# Altium schematic sheet 1_P1.schdoc
size 309 x 223 mm; Symbol: Sheet-Symbol_A4; Device: Sheet-Symbol_A4; Company: 嘉立创EDA; Version: V1.0; Page Size: A4; @Project Name: 鼠标终极板; @Page Count: 1; @Update Date: 2024-05-30; @Create Date: 2024-05-16; @Schematic Name: Schematic1; @Page No: 1; @Page Name: P1
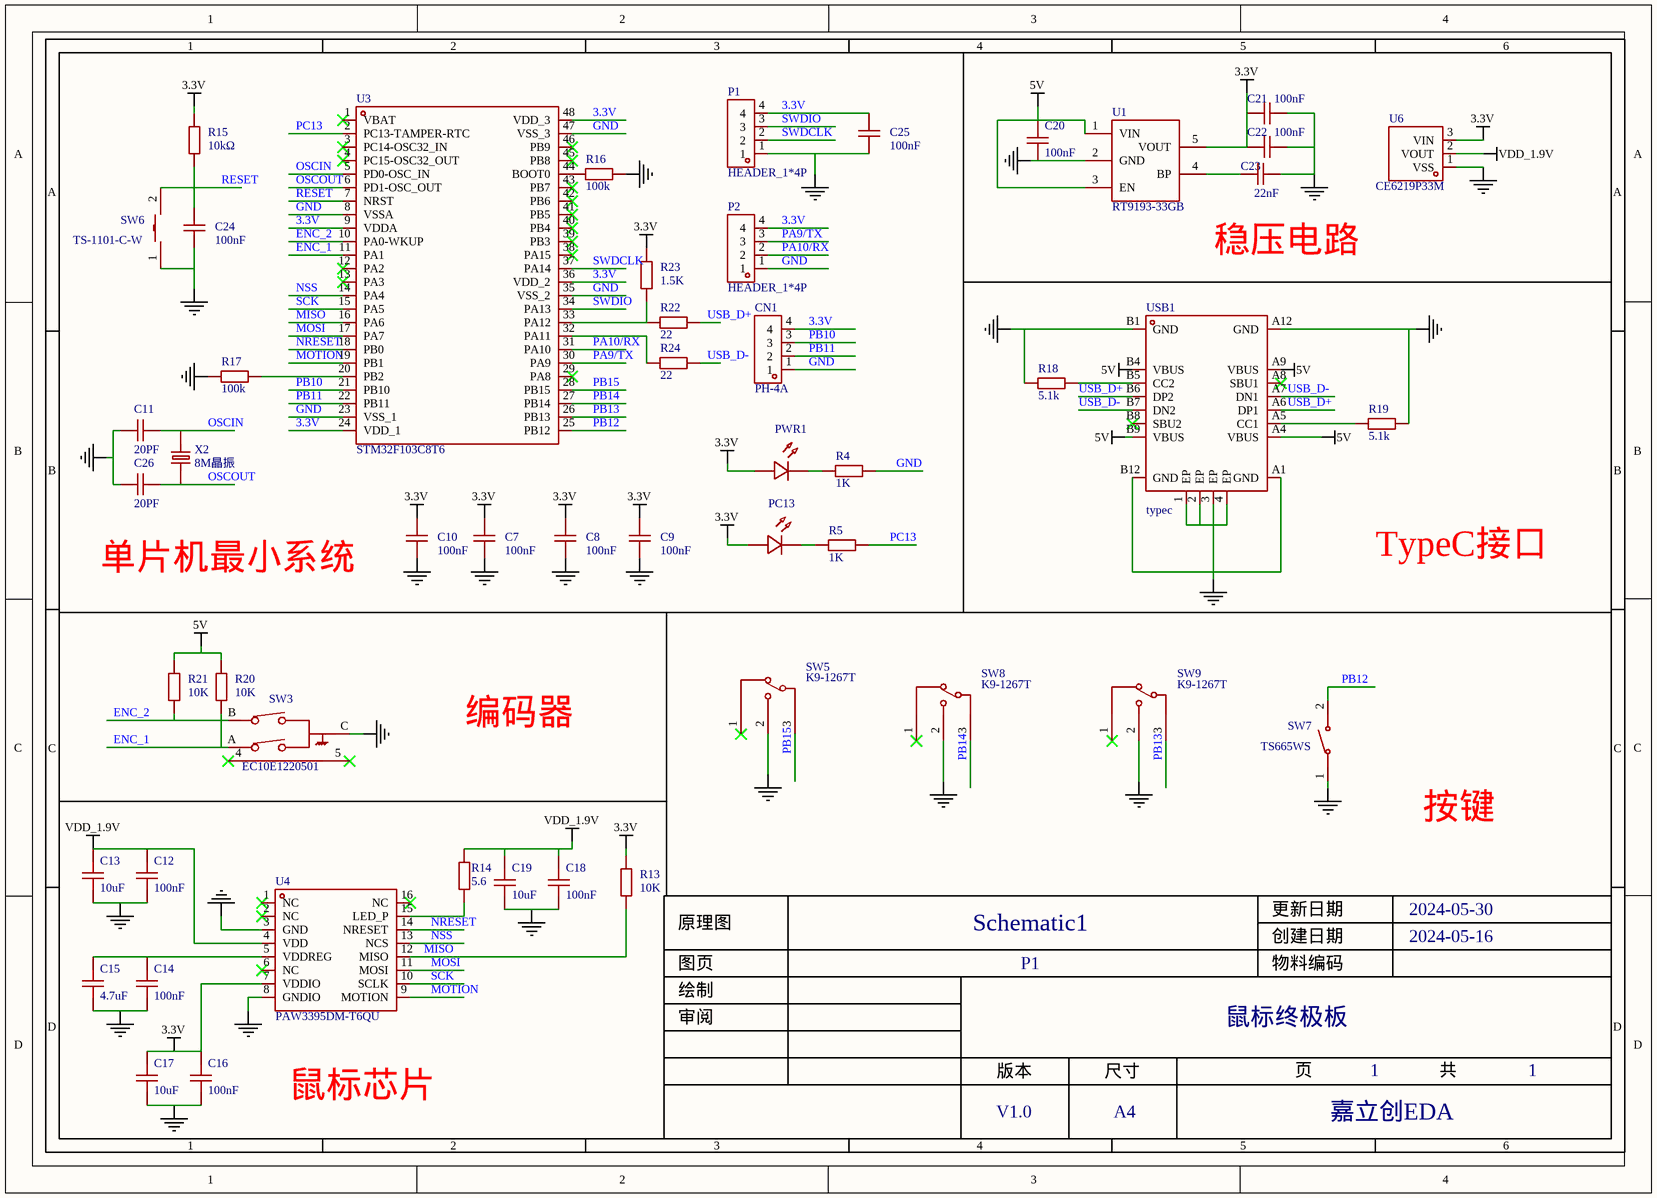
[diagram p0: 1_P1.schdoc]

## Parts
C7  100nF  [C0603]  (value not drawn)
C8  100nF  [C0603]  (value not drawn)
C9  100nF  [C0603]  (value not drawn)
C10  100nF  [C0603]  (value not drawn)
C11  20PF  [C0603]  (value not drawn)
C12  100nF  [C0603]  (value not drawn)
C13  10uF  [C0603]  (value not drawn)
C14  100nF  [C0603]  (value not drawn)
C15  4.7uF  [C0603]  (value not drawn)
C16  100nF  [C0603]  (value not drawn)
C17  10uF  [C0603]  (value not drawn)
C18  100nF  [C0603]  (value not drawn)
C19  10uF  [C0603]  (value not drawn)
C20  100nF  [C0603]  (value not drawn)
C21  100nF  [C0603]  (value not drawn)
C22  100nF  [C0603]  (value not drawn)
C23  22nF  [C0603]  (value not drawn)
C24  100nF  [C0603]  (value not drawn)
C25  100nF  [C0603]  (value not drawn)
C26  20PF  [C0603]  (value not drawn)
CN1  PH-4A  [CONN-TH_4P-P2.00_PH-4A_C2908625]  (value not drawn)
P1  HEADER_1*4P  [HDR-TH_4P-P2.54-V-M-1]  (value not drawn)
P2  HEADER_1*4P  [HDR-TH_4P-P2.54-V-M-1]  (value not drawn)
PC13  LED_0603-B  [LED_0603]  (value not drawn)
PWR1  LED_0603-R  [LED_0603]  (value not drawn)
R4  1K  [R0603]  (value not drawn)
R5  1K  [R0603]  (value not drawn)
R13  10K  [R0603]  (value not drawn)
R14  5.6  [R0603]  (value not drawn)
R15  10kΩ  [R0603]  (value not drawn)
R16  100k  [R0603]  (value not drawn)
R17  100k  [R0603]  (value not drawn)
R18  5.1k  [R0603]  (value not drawn)
R19  5.1k  [R0603]  (value not drawn)
R20  10K  [R0603]  (value not drawn)
R21  10K  [R0603]  (value not drawn)
R22  22  [R0603]  (value not drawn)
R23  1.5K  [R0603]  (value not drawn)
R24  22  [R0603]  (value not drawn)
SW3  EC10E1220501  [SW-TH_EC10EXXXXXXX]  (value not drawn)
SW5  K9-1267T  [SW-TH_K9-1267T]  (value not drawn)
SW6  TS-1101-C-W  [SW-SMD_L6.0-W3.3-LS8.0]  (value not drawn)
SW7  TS665WS  [SW-SMD_L6.0-W6.0-LS6.6]  (value not drawn)
SW8  K9-1267T  [SW-TH_K9-1267T]  (value not drawn)
SW9  K9-1267T  [SW-TH_K9-1267T]  (value not drawn)
U1  RT9193-33GB  [SOT-23-5_L3.0-W1.7-P0.95-LS2.8-BL]  (value not drawn)
U3  STM32F103C8T6  [LQFP-48_L7.0-W7.0-P0.50-LS9.0-BL]  (value not drawn)
U4  PAW3395DM-T6QU  [DIP-16_PAW3395DM-T6QU]  (value not drawn)
U6  CE6219P33M  [SOT-23-3_L2.9-W1.6-P1.90-LS2.8-BR]  (value not drawn)
USB1  typec  [USB-C-SMD_KH-TYPE-C-16P]  (value not drawn)
X2  8M晶振  [HC-49US_L11.5-W4.5-P4.88]  (value not drawn)

## Nets
3.3V: C7.1 C8.1 C9.1 C10.1 C16.2 C17.2 C21.2 C22.2 C25.1 CN1.4 P1.4 P2.4 PC13.2(A) PWR1.2(A) R13.2 R15.2 R23.1 U1.5(VOUT) U3.9(VDDA) U3.24(VDD_1) U3.36(VDD_2) U3.48(VDD_3) U4.7(VDDIO) U6.3(VIN)
5V: C20.2 R20.2 R21.2 U1.1(VIN) U1.3(EN) USB1.A4(VBUS) USB1.A9(VBUS) USB1.B4(VBUS) USB1.B9(VBUS)
GND: C7.2 C8.2 C9.2 C10.2 C11.1 C12.1 C13.1 C14.1 C15.1 C16.1 C17.1 C18.1 C19.1 C20.1 C21.1 C22.1 C23.1 C24.1 C25.2 C26.1 CN1.1 P1.1 P2.1 R4.1 R16.1 R17.1 R18.1 R19.2 SW3.C SW5.2(ON) SW6.1 SW7.1(A) SW8.2(ON) SW9.2(ON) U1.2(GND) U3.8(VSSA) U3.23(VSS_1) U3.35(VSS_2) U3.47(VSS_3) U4.3(GND) U4.8(GNDIO) U6.1(VSS) USB1.1(EP) USB1.2(EP) USB1.3(EP) USB1.4(EP) USB1.A1(GND) USB1.A12(GND) USB1.B1(GND) USB1.B12(GND)
VDD_1.9V: C12.2 C13.2 C18.2 C19.2 R14.2 U4.4(VDD) U6.2(VOUT)
ENC_1: R20.1 SW3.A U3.11(PA1)
ENC_2: R21.1 SW3.B U3.10(PA0-WKUP)
MISO: R13.1 U3.16(PA6) U4.12(MISO)
MOSI: U3.17(PA7) U4.11(MOSI)
MOTION: U3.19(PB1) U4.9(MOTION)
NRESET: U3.18(PB0) U4.14(NRESET)
NSS: U3.14(PA4) U4.13(NCS)
OSCIN: C11.2 U3.5(PD0-OSC_IN) X2.2
OSCOUT: C26.2 U3.6(PD1-OSC_OUT) X2.1
PA9/TX: P2.3 U3.30(PA9)
PA10/RX: P2.2 U3.31(PA10)
PB10: CN1.3 U3.21(PB10)
PB11: CN1.2 U3.22(PB11)
PB12: SW7.2(B) U3.25(PB12)
PB13: SW9.3(NC) U3.26(PB13)
PB14: SW8.3(NC) U3.27(PB14)
PB15: SW5.3(NC) U3.28(PB15)
PC13: R5.1 U3.2(PC13-TAMPER-RTC)
RESET: C24.2 R15.1 SW6.2 U3.7(NRST)
SCK: U3.15(PA5) U4.10(SCLK)
SWDCLK: P1.2 U3.37(PA14)
SWDIO: P1.3 U3.34(PA13)
USB_D+: R22.1 USB1.A6(DP1) USB1.B6(DP2)
USB_D-: R24.1 USB1.A7(DN1) USB1.B7(DN2)
NetC14_2: C14.2 C15.2 U4.5(VDDREG)
NetC23_2: C23.2 U1.4(BP)
NetPC13_1: PC13.1(C) R5.2
NetPWR1_1: PWR1.1(C) R4.2
NetR14_1: R14.1 U4.15(LED_P)
NetR16_2: R16.2 U3.44(BOOT0)
NetR17_2: R17.2 U3.20(PB2)
NetR18_2: R18.2 USB1.B5(CC2)
NetR19_1: R19.1 USB1.A5(CC1)
NetR22_2: R22.2 R23.2 U3.33(PA12)
NetR24_2: R24.2 U3.32(PA11)

Not connected (* = marked no-connect by the designer): SW3 4* 5*; SW5 1(C)*; SW8 1(C)*; SW9 1(C)*; U3 1(VBAT)* 3(PC14-OSC32_IN)* 4(PC15-OSC32_OUT)* 12(PA2)* 13(PA3)* 29(PA8)* 38(PA15)* 39(PB3)* 40(PB4)* 41(PB5)* 42(PB6)* 43(PB7)* 45(PB8)* 46(PB9)*; U4 1(NC)* 2(NC)* 6(NC)* 16(NC)*; USB1 A8(SBU1)* B8(SBU2)*

## Notes on the sheet
- 稳压电路
- 单片机最小系统
- TypeC接口
- 编码器
- 按键
- 鼠标芯片
- 1
- 2
- 3
- 4
- 5
- 6
- A
- B
- C
- 原理图
- Schematic1
- 创建日期
- 更新日期
- 2024-05-30
- 2024-05-16
- 审阅
- 绘制
- 图页
- P1
- 物料编码
- 鼠标终极板
- D
- 版本
- 尺寸
- 页
- 共
- V1.0
- A4
- 嘉立创EDA

## Library data of the parts
C7-C11 C20-C26 = 0603B104K500NT: 容值:100nF;精度:±10%;额定电压:50V;材质(温度系数):X7R;; Manufacturer: FH(风华); Add into BOM: yes; Tolerance: ±10%; Voltage Rated: 50V; Temperature Coefficient: X7R; Symbol: 0603B104K500NT; Device: 0603B104K500NT; LCSC Part Name: 100nF ±10% 50V; Supplier Part: C30926; Manufacturer Part: 0603B104K500NT; Supplier Footprint: 0603; JLCPCB Part Class: 扩展库; Datasheet: https://atta.szlcsc.com/upload/public/pdf/source/20170923/C30926_1506149436298988724.pdf; Supplier: LCSC; Convert to PCB: yes
  C7-C10 C20-C22 C24 C25: Value: 100nF
  C11 C26: Value: 20PF
  C23: Value: 22nF
C12-C19 = CAP_0603: Symbol: CapAcitance; Convert to PCB: yes; Device: CAP_0603; Add into BOM: yes; Supplier Footprint: 0603
  C12 C14 C16 C18: Value: 100nF
  C13 C17 C19: Value: 10uF
  C15: Value: 4.7uF
CN1 = PH-4A_C2908625: 插针结构:1x4P;间距:2mm;安装方式:直插;参考系列:PH;总PIN数:4P;排数:1;每排PIN数:4;行距:-;额定电流:2A;触头材质:黄铜;触头镀层:锡;工作温度范围:-25℃~+85℃;; Manufacturer: HCTL(华灿天禄); Add into BOM: yes; Pins Structure: 1x4P; Pitch: 2mm; Reference Series: PH; Number of PINs Per Row: 4; Current Rating (Max): 2A; Symbol: PH-4A_C2908625; Device: PH-4A_C2908625; LCSC Part Name: 1x4P 间距:2mm 直插 系列:PH; Supplier Part: C2908625; Manufacturer Part: PH-4A; Supplier Footprint: 插件,P=2mm; JLCPCB Part Class: 扩展库; Datasheet: https://atta.szlcsc.com/upload/public/pdf/source/20230707/BA576CECAD32FECA9ECBAF2430E681CE.pdf; Supplier: LCSC; Convert to PCB: yes; Mounting Style: 直插; Number of Pins: 4P; Number of Rows: 1; Row Spacing: -; Contact Material: 黄铜; Contact Plating: 锡; Operating Temperature Range: -25℃~+85℃
P1 P2 = HEADER_1*4P: Add into BOM: yes; Symbol: HEADER_1*4P; Device: HEADER_1*4P; LCSC Part Name: HEADER_1*4P; Supplier Part: C9900003200; Manufacturer Part: HEADER_1*4P; Supplier Footprint: TH-4P; JLCPCB Part Class: 扩展库; Datasheet: https://atta.szlcsc.comnull; Supplier: LCSC; Convert to PCB: yes
PC13 = LED_0603-B: Symbol: LED_B; Convert to PCB: yes; Device: LED_0603-B; Add into BOM: yes; Supplier Footprint: 0603
PWR1 = LED_0603-R: Symbol: LED_R; Convert to PCB: yes; Device: LED_0603-R; Add into BOM: yes; Supplier Footprint: 0603
R4 R5 R15-R17 R22-R24 = 0603WAF1002T5E: 电阻类型:厚膜电阻;阻值:10kΩ;精度:±1%;功率:100mW;; Manufacturer: UNI-ROYAL(厚声); Add into BOM: yes; Tolerance: ±1%; Power(Watts): 100mW; Temperature Coefficient: ±100ppm/℃; Overload Voltage (Max): 75V; Symbol: 0603WAF1002T5E; Device: 0603WAF1002T5E; LCSC Part Name: 厚膜电阻 10kΩ ±1% 100mW; Supplier Part: C25804; Manufacturer Part: 0603WAF1002T5E; Supplier Footprint: 0603; JLCPCB Part Class: 基础库; Datasheet: https://atta.szlcsc.com/upload/public/pdf/source/20200306/C422600_1E6D84923E4A46A82E41ADD87F860B5C.pdf; Supplier: LCSC; Convert to PCB: yes; Type: 厚膜电阻; Operating Temperature Range: -55℃~+155℃
  R4 R5: Value: 1K
  R15: Value: 10kΩ
  R16 R17: Value: 100k
  R22 R24: Value: 22
  R23: Value: 1.5K
R13 R14 R18-R21 = Res_0603: Symbol: 电阻; Convert to PCB: yes; Device: Res_0603; Add into BOM: yes; Supplier Footprint: 0603
  R13 R20 R21: Value: 10K
  R14: Value: 5.6
  R18 R19: Value: 5.1k
SW3 = EC10E1220501: 10型贯通轴型; Manufacturer: ALPSALPINE(阿尔卑斯阿尔派); Add into BOM: yes; Symbol: EC10E1220501; Device: EC10E1220501; LCSC Part Name: EC10E1220501; Supplier Part: C160889; Manufacturer Part: EC10E1220501; Supplier Footprint: 插件; JLCPCB Part Class: 扩展库; Datasheet: https://atta.szlcsc.com/upload/public/pdf/source/20180227/C160889_15197014267581370273.pdf; Supplier: LCSC; Convert to PCB: yes
SW5 SW8 SW9 = K9-1267T: 类型:微动开关;电路结构:单刀双掷;额定电流(DC):100mA;额定电压(DC):30V;额定电流(AC):-;额定电压(AC):-;机械寿命:300万次;; Manufacturer: 韩国韩荣; Add into BOM: yes; Circuit: 单刀双掷; Switch Length: 12.7mm; Switch Width: 5.7mm; Switch Height: 7.5mm; Contact Current (DC): 100mA; Voltage Rating (DC): 30V; Mechanical Life: 300万次; Symbol: K9-1267T; Device: K9-1267T; LCSC Part Name: 12.7*5.7*7.5mm 插件微动开关; Supplier Part: C107266; Manufacturer Part: K9-1267T; Supplier Footprint: 插件; JLCPCB Part Class: 扩展库; Datasheet: https://atta.szlcsc.com/upload/public/pdf/source/20170413/1492062748888.pdf; Supplier: LCSC; Convert to PCB: yes; Type: 微动开关; Contact Current (AC): -; Voltage Rating (AC): -; Operating Temperature: -25℃~+85℃
SW6 = TS-1101-C-W: 触点电流:50mA;额定电压(AC):-;额定电压(DC):12V;额定功率:-;绝缘电阻:-;电路结构:单刀单掷;安装方式:立贴;带灯:无;作用力:260gf;机械寿命:5万次;带支架:否;; Manufacturer: XKB Connectivity(中国星坤); Add into BOM: yes; Contact Current: 50mA; Voltage Rating (DC): 12V; Circuit: 单刀单掷; Actuator Style: 矩形按钮; Actuator/Cap Color: 白色带淡绿; With Lamp: 无; Operating Force: 260gf; Mechanical Life: 5万次; Switch Length: 6mm; Switch Width: 3.6mm; Switch Height: 2.5mm; Strike Gundam: 否; Symbol: TS-1101-C-W; Device: TS-1101-C-W; LCSC Part Name: 立贴 6*3.6*2.5mm 轻触开关 一型3*6*2.5有白ZD b拉伸白色带淡绿按键 卷装; Supplier Part: C318938; Manufacturer Part: TS-1101-C-W; Supplier Footprint: SMD; JLCPCB Part Class: 扩展库; Datasheet: https://atta.szlcsc.com/upload/public/pdf/source/20200227/C318938_C2E53B1EEDE37D980A33616AC086DE53.pdf; Supplier: LCSC; Convert to PCB: yes; Voltage Rating (AC): -; Power Rating: -; Insulation Resistance: -; Mounting Style: 立贴; Operating Temperature: -30℃~+85℃; IP Rating: -; Pin Style: -; Diameter: -
SW7 = TS665WS_C398058: 电路结构:单刀单掷;按钮形状:圆形按钮;作用力:200gf;安装方式:立贴;开关长度:6mm;开关宽度:6mm;开关高度:5mm;触点电流:50mA;额定电压(DC):12V;带灯:-;机械寿命:-;; Manufacturer: SHOU HAN(首韩); Add into BOM: yes; Circuit: 单刀单掷; Actuator Style: 圆形按钮; Operating Force: 200gf; Switch Length: 6mm; Switch Height: 5mm; Contact Current: 50mA; Voltage Rating (DC): 12V; Symbol: TS665WS; Device: TS665WS_C398058; Supplier: LCSC; Supplier Part: C398058; Manufacturer Part: TS665WS; JLCPCB Part Class: 扩展库; LCSC Part Name: 6*6*5mm 立贴 轻触开关; Supplier Footprint: SMD; Datasheet: https://atta.szlcsc.com/upload/public/pdf/source/20190620/C398058_75EC11C2CCBC6DD113AE79D58CB25A40.pdf; Convert to PCB: yes; Mounting Style: 立贴; Switch Width: 6mm; With Lamp: -; Mechanical Life: -
U1 = RT9193-33GB: 输出类型:固定;输出极性:正;输出通道数:1;最大输入电压:5.5V;输出电压:3.3V;压差:300mV@(300mA);输出电流:300mA;电源纹波抑制比(PSRR):70dB;; Manufacturer: RICHTEK(立锜); Add into BOM: yes; Output Type: 固定; Output Polarity: 正; Number of Outputs: 1; Maximum Input Voltage: 5.5V; Output Voltage: 3.3V; Power Supply Rejection Ratio (PSRR): 70dB; Symbol: RT9193-33GB; Device: RT9193-33GB; LCSC Part Name: 正 Vin=5.5V Vout=3.3V 300mA 70dB; Supplier Part: C15651; Manufacturer Part: RT9193-33GB; Supplier Footprint: SOT-23-5; JLCPCB Part Class: 扩展库; Datasheet: https://atta.szlcsc.com/upload/public/pdf/source/20130730/1457706628575.pdf; Supplier: LCSC; Convert to PCB: yes; Dropout Voltage: 300mV@(300mA); Output Current: 300mA
U3 = STM32F103C8T6: CPU内核:ARM Cortex-M3;CPU最大主频:72MHz;工作电压范围:2V~3.6V;程序存储容量:64KB;程序存储器类型:FLASH;RAM总容量:20KB;GPIO端口数量:37;; Manufacturer: ST(意法半导体); Add into BOM: yes; CPU Maximum Speed: 72MHz; Program Storage Size: 64KB; Program Memory Type: FLASH; RAM Size: 20KB; GPIO Ports Number: 37; ADC (Bit): 12bit; Universal Serial Bus: 有; Peripheral/Function: 看门狗；DMA；看门狗；片载温度传感器; Symbol: STM32F103C8T6; Device: STM32F103C8T6; Supplier: LCSC; Manufacturer Part: STM32F103C8T6; Supplier Part: C8734; JLCPCB Part Class: 扩展库; LCSC Part Name: STM32F103C8T6 MSL=3; Supplier Footprint: LQFP-48(7x7); Datasheet: https://atta.szlcsc.com/upload/public/pdf/source/20220812/8363ACEC51AD55ECEB84799464F7CB85.pdf; Convert to PCB: yes; CPU Core: ARM Cortex-M3; Operating Voltage Range: 2V~3.6V; EEPROM: -; DAC (Bit): -; PWM (Bit): -; Internal Comparator: -; communication protocol: -; Watchdog: 有; Real-Time Clock: -; Infrared Data Association: 有; Low-Voltage Detect: 有; CCP Capture/Compare: -; Secure Digital Input and Output: -; Direct Memory Access: 有; Internal Oscillator: 有; Operating Temperature Range: -40℃~+85℃
U4 = PAW3395DM-T6QU: Add into BOM: yes; Symbol: PAW3395DM-T6QU; Device: PAW3395DM-T6QU; LCSC Part Name: PAW3395DM-T6QU; Supplier Part: C9900026543; Manufacturer Part: PAW3395DM-T6QU; Supplier Footprint: 16-PDIP; Supplier: LCSC; Convert to PCB: yes
U6 = CE6219P33M: Add into BOM: yes; Symbol: CE6219P33M; Device: CE6219P33M; LCSC Part Name: CE6219P33M; Supplier Part: C9900023885; Manufacturer Part: CE6219P33M; Supplier Footprint: SOT-23; JLCPCB Part Class: 扩展库; Supplier: LCSC; Convert to PCB: yes
USB1 = typec: Symbol: TYPEC_C9900016956; Add into BOM: yes; Device: typec; LCSC Part Name: typec; Supplier Part: C9900016956; Manufacturer Part: typec; Supplier Footprint: typec 12p; JLCPCB Part Class: 扩展库; Supplier: LCSC; Convert to PCB: yes
X2 = XIHCELNANF-8MHZ: 频率:-;负载电容:-;; Manufacturer: TAITIEN(泰艺电子); Add into BOM: yes; Symbol: XIHCELNANF-8MHZ; Device: XIHCELNANF-8MHZ; LCSC Part Name: 8MHZ 20PF30PPM -40℃~+85℃DIP; Supplier Part: C295088; Manufacturer Part: XIHCELNANF-8MHZ; Supplier Footprint: HC-49S; JLCPCB Part Class: 扩展库; Datasheet: https://atta.szlcsc.com/upload/public/pdf/source/20180928/C295088_870B1C8FD6918B666D832F79126576C6.pdf; Supplier: LCSC; Convert to PCB: yes; Crystal Type: -; Value: 8M晶振; Load Capacitance: -; Operating Temperature: -